# EAGLE design stepper-motor-driver (EAGLE 5.06)
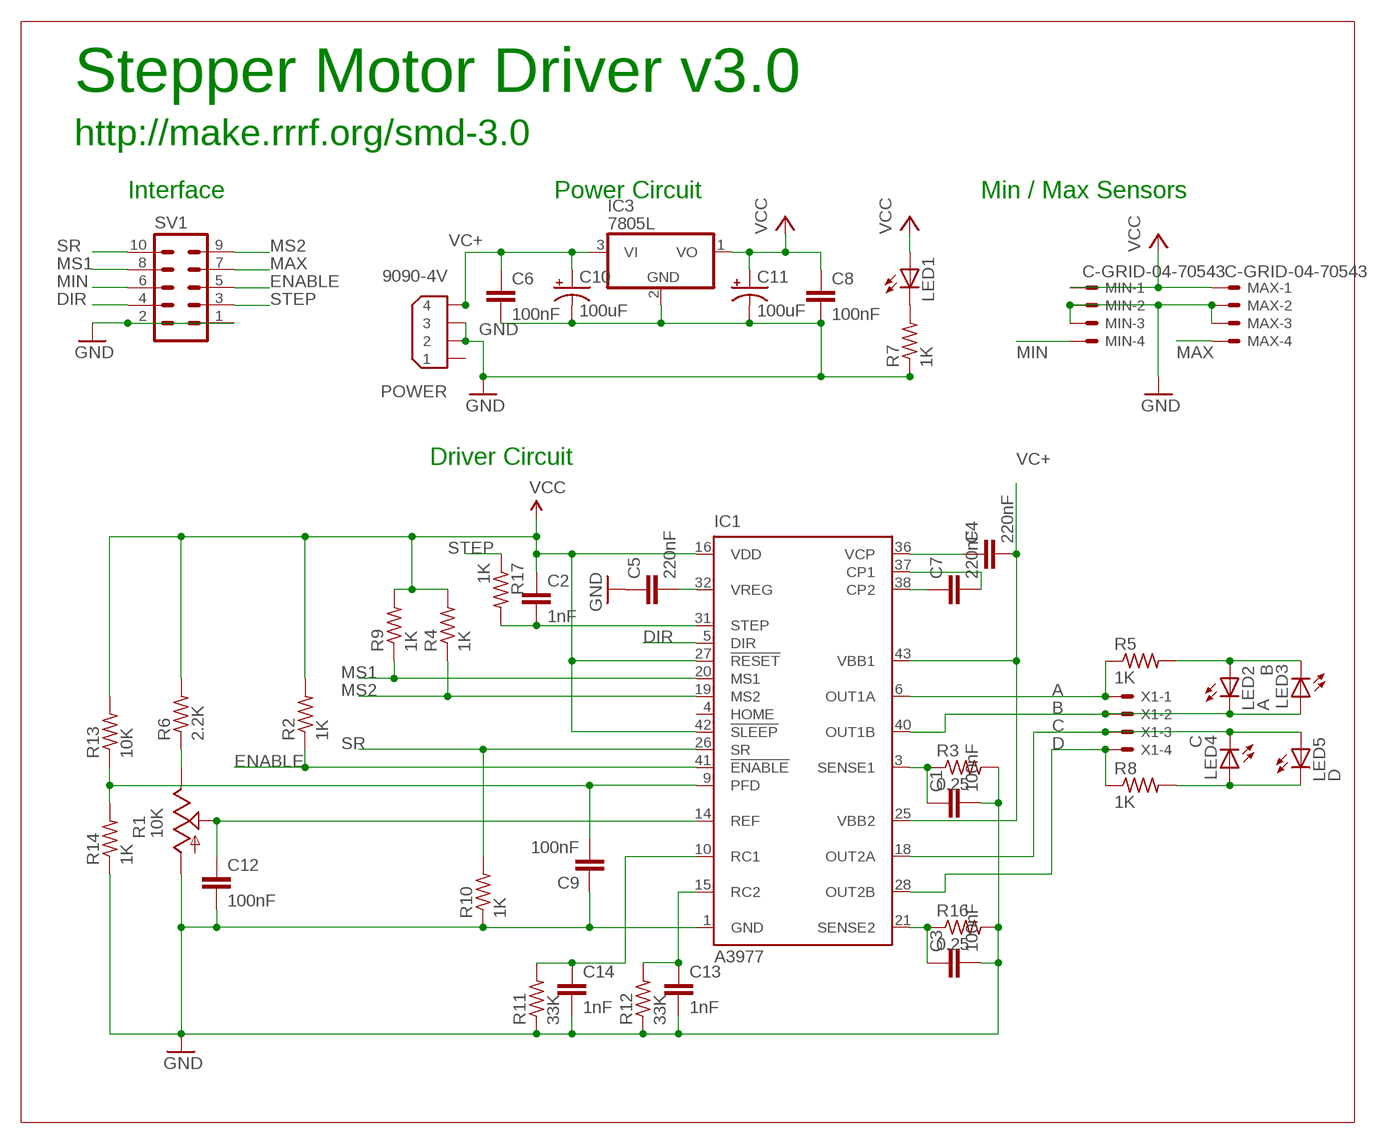
[diagram p0: schematic, sheet 1]

## Parts
C1  100nF  C-EUC1206  [C1206]
C2  1nF  C-EUC1206K  [C1206K]
C3  100nF  C-EUC1206  [C1206]
C4  220nF  C-EUC1206  [C1206]
C5  220nF  C-EUC1206  [C1206]
C6  100nF  C-EUC1206K  [C1206K]
C7  220nF  C-EUC1206  [C1206]
C8  100nF  C-EUC1206K  [C1206K]
C9  100nF  C-EUC1206  [C1206]
C10  100uF  CPOL-USE3.5-8  [E3,5-8]
C11  100uF  CPOL-USE3.5-8  [E3,5-8]
C12  100nF  C-EUC1206  [C1206]
C13  1nF  C-EUC1206  [C1206]
C14  1nF  C-EUC1206  [C1206]
IC1  A3977  [PLCC44]
IC3  7805L  [TO92]
LED1  LEDCHIPLED_1206  [CHIPLED_1206]
LED2  A  LEDCHIPLED_1206  [CHIPLED_1206]
LED3  B  LEDCHIPLED_1206  [CHIPLED_1206]
LED4  C  LEDCHIPLED_1206  [CHIPLED_1206]
LED5  D  LEDCHIPLED_1206  [CHIPLED_1206]
MAX  C-GRID-04-70543  [70543-04]
MIN  C-GRID-04-70543  [70543-04]
POWER  9090-4V  [9090-4V]
R1  10K  TRIM_US-B25P  [B25P]
R2  1K  R-US_R1206  [R1206]
R3  0.25  R-US_R2512  [R2512]
R4  1K  R-US_R1206  [R1206]
R5  1K  R-US_R1206  [R1206]
R6  2.2K  R-US_R1206  [R1206]
R7  1K  R-US_R1206  [R1206]
R8  1K  R-US_R1206  [R1206]
R9  1K  R-US_R1206  [R1206]
R10  1K  R-US_R1206  [R1206]
R11  33K  R-US_R1206  [R1206]
R12  33K  R-US_R1206  [R1206]
R13  10K  R-US_R1206  [R1206]
R14  1K  R-US_R1206  [R1206]
R16  0.25  R-US_R2512  [R2512]
R17  1K  R-US_R1206  [R1206]
SV1  ML10  [ML10]
X1  KK-156-4  [KK-156-4]

## Nets
A [Power]: IC1.6(OUT1A) R5.1 X1.1
B [Power]: IC1.40(OUT1B) LED2.C LED3.A X1.2
C [Power]: IC1.18(OUT2A) LED4.C LED5.A X1.3
D [Power]: IC1.28(OUT2B) R8.1 X1.4
DIR: IC1.5(DIR) SV1.4
ENABLE: IC1.41(!ENABLE) R2.1 SV1.5
GND [Power]: C1.2 C3.2 C5.1 C6.2 C8.2 C9.1 C10.- C11.- C12.2 C13.2 C14.2 IC1.1(GND) IC3.2(GND) MAX.2 MAX.3 MIN.2 MIN.3 POWER.2 POWER.3 R1.A R3.2 R7.1 R10.1 R11.1 R12.1 R14.1 R16.2 SV1.1 SV1.2
MAX: MAX.4 SV1.7
MIN: MIN.4 SV1.6
MS1: IC1.20(MS1) R9.1 SV1.8
MS2: IC1.19(MS2) R4.1 SV1.9
N$1: C1.1 IC1.3(SENSE1) R3.1
N$2: C3.1 IC1.21(SENSE2) R16.1
N$3: C9.2 IC1.9(PFD) R13.1 R14.2
N$4: C13.1 IC1.15(RC2) R12.2
N$5: C14.1 IC1.10(RC1) R11.2
N$6: R1.E R6.1
N$7: C5.2 IC1.32(VREG)
N$8: LED1.C R7.2
N$10 [Power]: LED2.A LED3.C R5.2
N$11: C7.1 IC1.38(CP2)
N$12 [Power]: LED4.A LED5.C R8.2
N$13: C12.1 IC1.14(REF) R1.S
N$14: C2.2 IC1.31(STEP) R17.2
N$15: C7.2 IC1.37(CP1)
N$16: C4.1 IC1.36(VCP)
SR: IC1.26(SR) R10.2 SV1.10
STEP: R17.1 SV1.3
VC+ [Power]: C4.2 C6.1 C10.+ IC1.25(VBB2) IC1.43(VBB1) IC3.3(VI) POWER.4
VCC: C2.1 C8.1 C11.+ IC1.16(VDD) IC1.27(!RESET) IC1.42(!SLEEP) IC3.1(VO) LED1.A MAX.1 MIN.1 R2.2 R4.2 R6.2 R9.2 R13.2
Unconnected: IC1.4(HOME) POWER.1

## Notes on the sheet
- Stepper Motor Driver v3.0
- http://make.rrrf.org/smd-3.0
- Interface | Power Circuit | Min / Max Sensors
- Driver Circuit

## Power pins joined to a net without a drawn wire
GND: IC1.2(GND) IC1.11(GND) IC1.12(GND) IC1.13(GND) IC1.22(GND) IC1.23(GND) IC1.24(GND) IC1.33(GND) IC1.34(GND) IC1.35(GND) IC1.44(GND)

## Library data of the parts
C1-C9 C13 C14 = rcl:C-EU: CAPACITOR, European symbol
C10 C11 = rcl:CPOL-US: POLARIZED CAPACITOR, American symbol
C12 = resistor:C-EU: CAPACITOR, European symbol
IC1 = linear:A3977: MICROSTEPPING DMOS DRIVER WITH TRANSLATOR Source: http://allegromicro.com/datafile/3977.pdf
IC3 = linear:78*: Positive VOLTAGE REGULATOR Source: http://cache.national.com/ds/LM/LM78L05.pdf http://www.fairchildsemi.com/ds/LM/LM7805.pdf
LED1-LED5 = led:LED: LED OSRAM: - CHIPLED LG R971, LG N971, LY N971, LG Q971, LY Q971, LO R971, LY R971 LH N974, LH R974 LS Q976, LO Q976, LY Q976 LO Q996 - Hyper CHIPLED LW Q18S LB Q993, LB Q99A, LB R99A - SideLED LS A670, LO A670, LY A670, LG A670, LP A670 LB A673, LV A673, LT A673, LW A673 LH A674 LY A675 LS A676, LA A676, LO A676, LY A676, LW A676 LS A679, LY A679, LG A679 - Hyper Micro SIDELED® LS Y876, LA Y876, LO Y876, LY Y876 LT Y87S - SmartLED LW L88C, LW L88S LB L89C, LB L89S, LG L890 LS L89K, LO L89K, LY L89K LS L896, LA L896, LO L896, LY L896 - TOPLED LS T670, LO T670, LY T670, LG T670, LP T670 LSG T670, LSP T670, LSY T670, LOP T670, LYG T670 LG T671, LOG T671, LSG T671 LB T673, LV T673, LT T673, LW T673 LH T674 LS T676, LA T676, LO T676, LY T676, LB T676, LH T676, LSB T676, LW T676 LB T67C, LV T67C, LT T67C, LS T67K, LO T67K, LY T67K, LW E67C LS E67B, LA E67B, LO E67B, LY E67B, LB E67C, LV E67C, LT E67C LW T67C LS T679, LY T679, LG T679 LS T770, LO T770, LY T770, LG T770, LP T770 LB T773, LV T773, LT T773, LW T773 LH T774 LS E675, LA E675, LY E675, LS T675 LS T776, LA T776, LO T776, LY T776, LB T776 LHGB T686 LT T68C, LB T68C - Hyper Mini TOPLED® LB M676 - Mini TOPLED Santana® LG M470 LS M47K, LO M47K, LY M47K Source: http://www.osram.convergy.de - LUMILED® LXK2-PW12-R00, LXK2-PW12-S00, LXK2-PW14-U00, LXK2-PW14-V00 LXK2-PM12-R00, LXK2-PM12-S00, LXK2-PM14-U00 LXK2-PE12-Q00, LXK2-PE12-R00, LXK2-PE12-S00, LXK2-PE14-T00, LXK2-PE14-U00 LXK2-PB12-K00, LXK2-PB12-L00, LXK2-PB12-M00, LXK2-PB14-N00, LXK2-PB14-P00, LXK2-PB14-Q00 LXK2-PR12-L00, LXK2-PR12-M00, LXK2-PR14-Q00, LXK2-PR14-R00 LXK2-PD12-Q00, LXK2-PD12-R00, LXK2-PD12-S00 LXK2-PH12-R00, LXK2-PH12-S00 LXK2-PL12-P00, LXK2-PL12-Q00, LXK2-PL12-R00 Source: www.luxeon.com
MAX MIN = reprap:C-GRID-04: CONNECTOR wire to board 2.54 mm (0.100") pitch header
POWER = con-thomas-betts:9090-4: Disk Drive Power four position Source: Thomas & Betts Electronic Interconnects Eiropean Edition 1998
R1 = reprap:TRIM_US-: POTENTIOMETER
R2 R4 R5 R9-R12 = resistor:R-US_: RESISTOR, American symbol
R3 R6-R8 R13 R14 R16 R17 = rcl:R-US_: RESISTOR, American symbol
SV1 = con-harting-ml:ML10: HARTING
X1 = con-molex:KK-156-4: KK 156 HEADER Source: http://www.molex.com/pdm_docs/sd/026604100_sd.pdf

## Net classes
0 default: width 0.381 mm
1 Power: width 0.635 mm, drill 0.381 mm, clearance 0.508 mm
2 Trunk: width 1.676 mm, clearance 0.508 mm

## Board
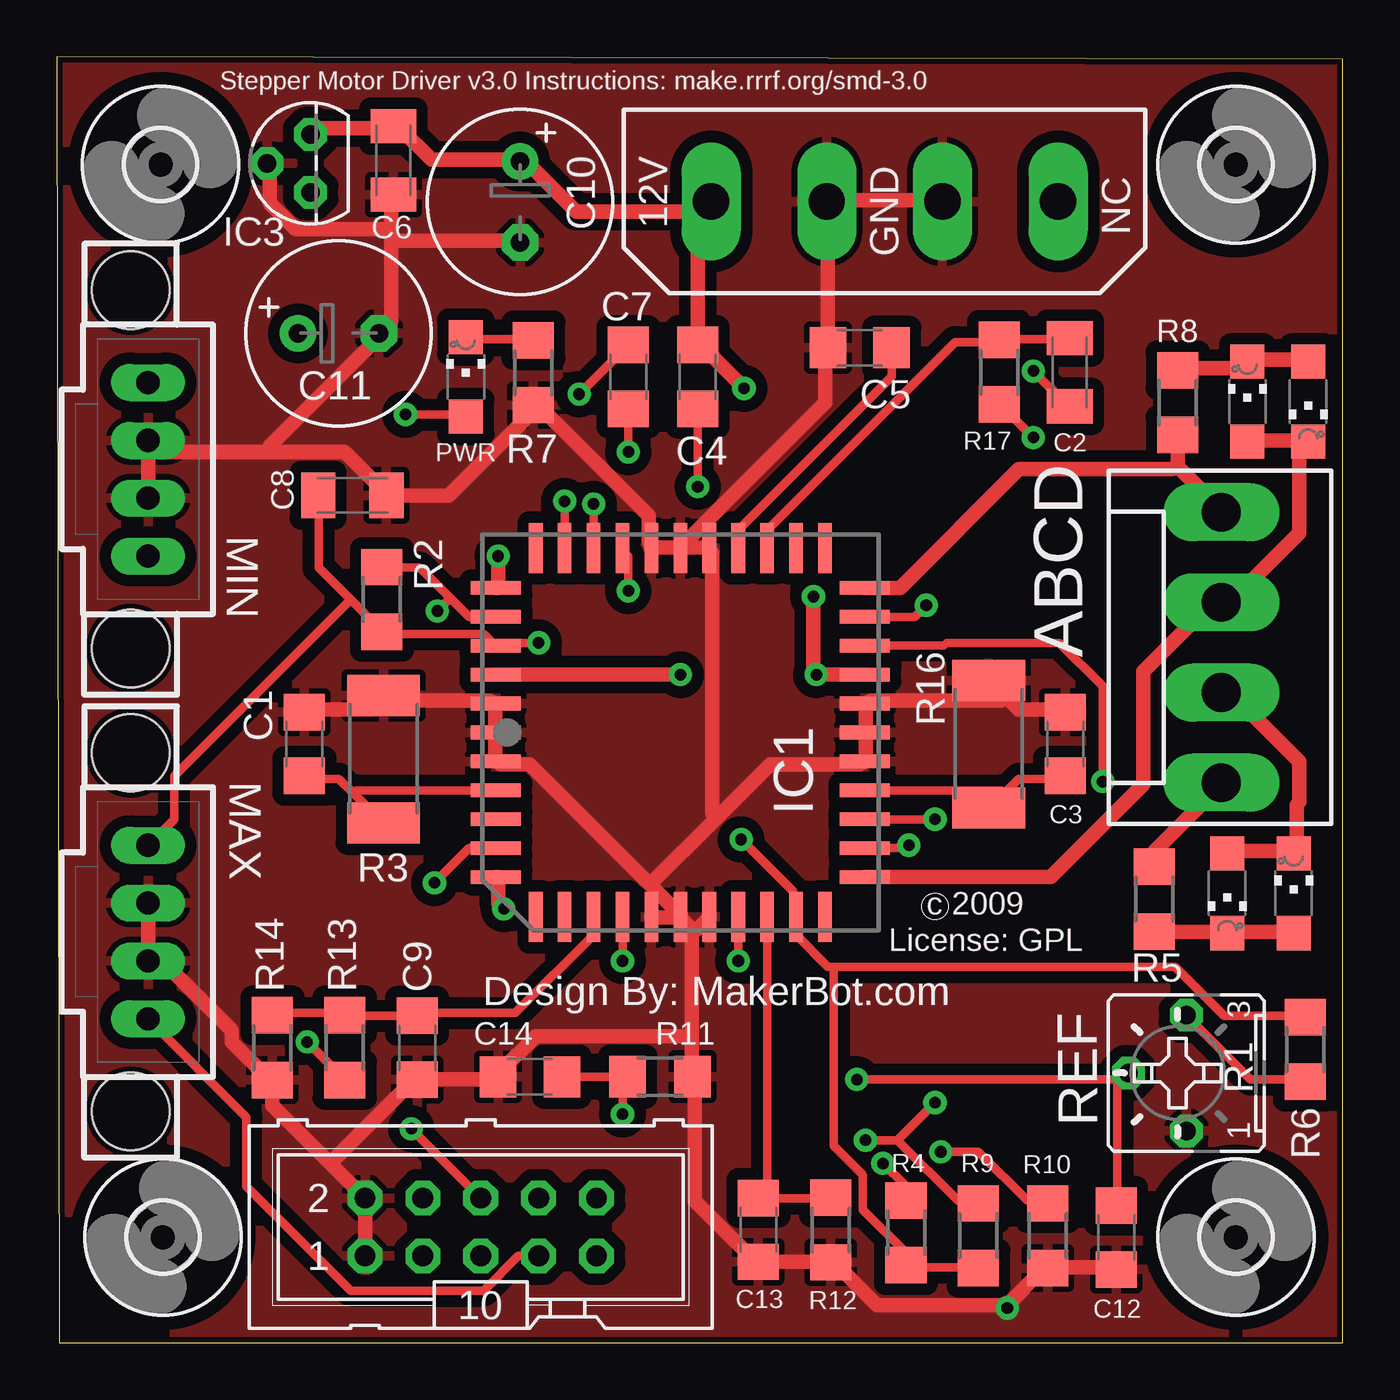
[diagram p1: board, top side]
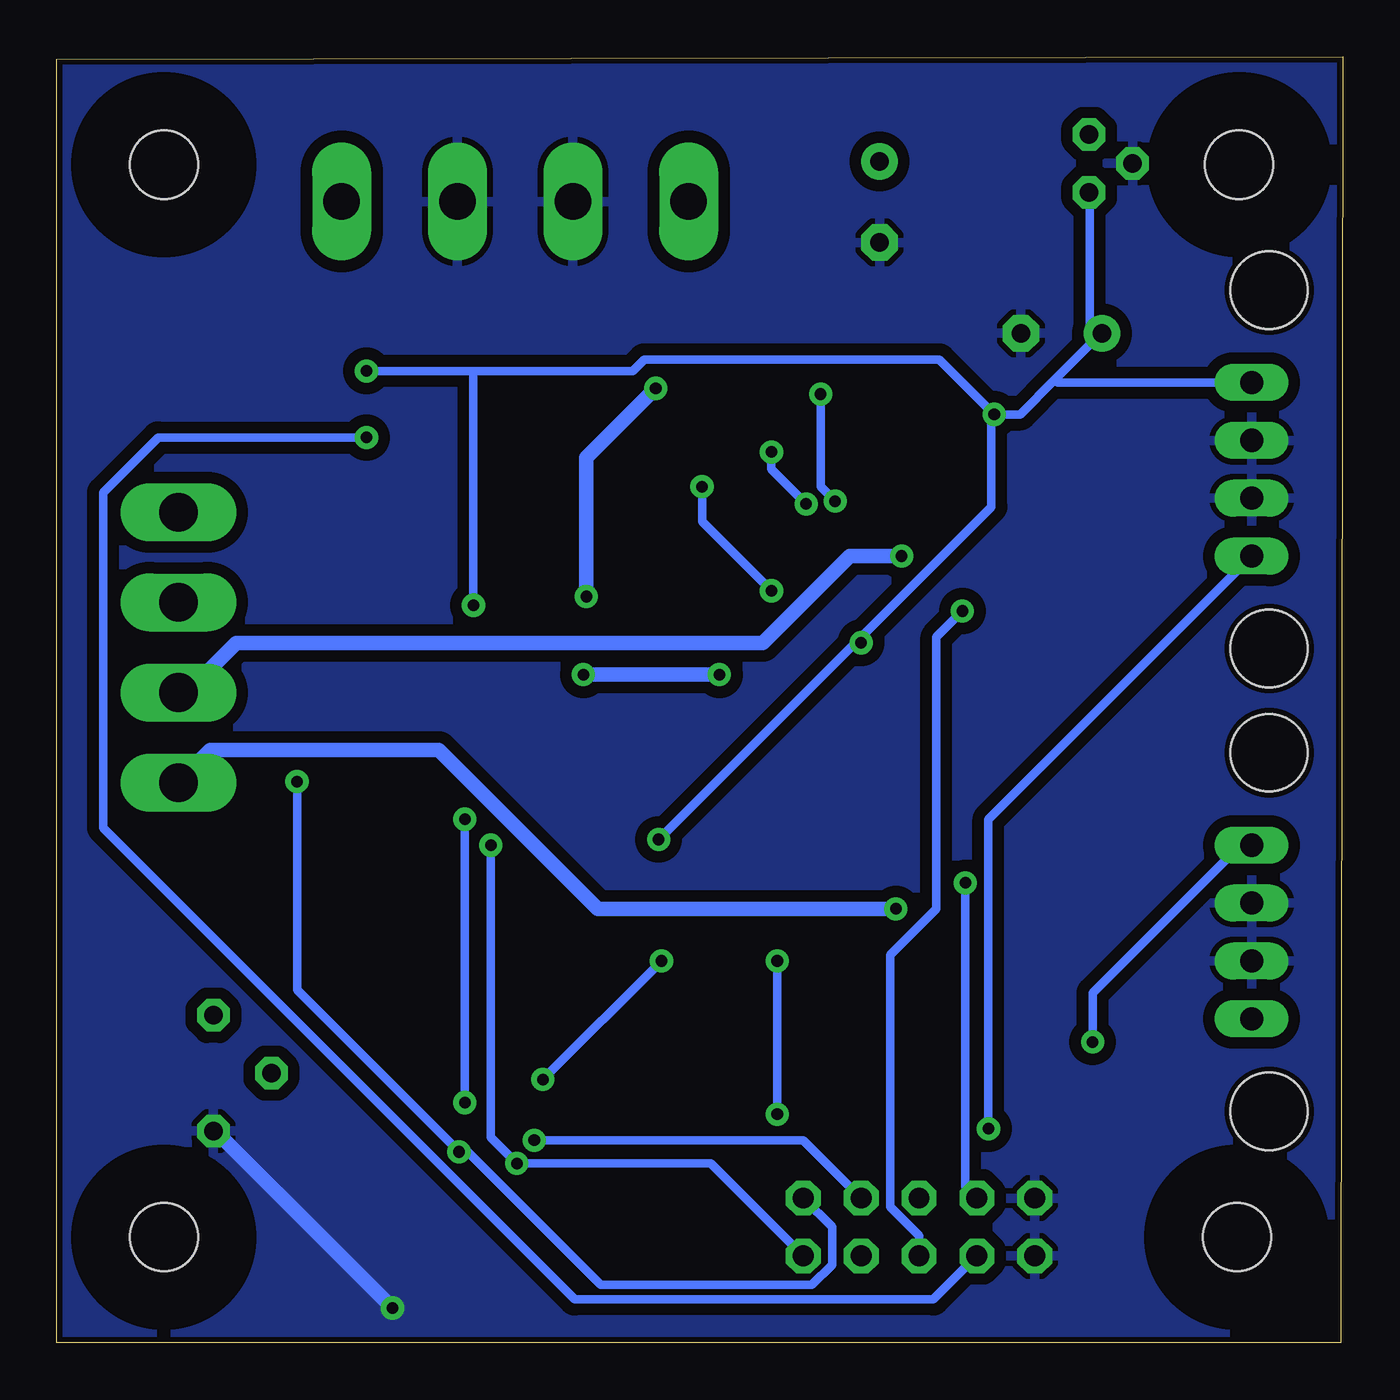
[diagram p2: board, bottom side, seen from below]

Size 56.45 x 56.46 mm. Coordinates in mm from the lower left corner, seen from the top.
Outline: 0.1,0 56.45,0 56.45,56.36 0,56.46 0.1,0
Copper layers (1*16): Top 0.035mm / dielectric 1.5mm / Bottom 0.035mm
Design rules "SparkFun": minimum track width 8mil, minimum drill 20mil, track to track 8mil, track to pad 8mil, pad to pad 8mil, via to via 8mil, smd to smd 8mil, copper to edge 10mil, drill to drill 8mil, minimum pad ring 12mil, minimum via ring 10mil, stop-mask expansion 4mil, vias tented up to drill 25mil, thermal gap 10mil

### Footprints (pad centres in the part's own frame; a part is rotated, then mirrored left to right if it is on the bottom)
C1206 = smd 1.6 x 1.8: 1 -1.4,0; 2 1.4,0
C1206K = smd 1.5 x 2: 1 -1.5,0; 2 1.5,0
E3,5-8 = drill 0.813 pad 1.6 round: + -1.778,0 | drill 0.813 pad 1.6 octagon: - 1.778,0
PLCC44 = smd 0.6 x 2.2: 1 0,8.1; 2 -1.27,8.1; 3 -2.54,8.1; 4 -3.81,8.1; 5 -5.08,8.1; 6 -6.35,8.1; 18 -6.35,-8.1; 19 -5.08,-8.1; 20 -3.81,-8.1; 21 -2.54,-8.1; 22 -1.27,-8.1; 23 0,-8.1; 24 1.27,-8.1; 25 2.54,-8.1; 26 3.81,-8.1; 27 5.08,-8.1; 28 6.35,-8.1; 40 6.35,8.1; 41 5.08,8.1; 42 3.81,8.1; 43 2.54,8.1; 44 1.27,8.1 | smd 2.2 x 0.6: 7 -8.1,6.35; 8 -8.1,5.08; 9 -8.1,3.81; 10 -8.1,2.54; 11 -8.1,1.27; 12 -8.1,0; 13 -8.1,-1.27; 14 -8.1,-2.54; 15 -8.1,-3.81; 16 -8.1,-5.08; 17 -8.1,-6.35; 29 8.1,-6.35; 30 8.1,-5.08; 31 8.1,-3.81; 32 8.1,-2.54; 33 8.1,-1.27; 34 8.1,0; 35 8.1,1.27; 36 8.1,2.54; 37 8.1,3.81; 38 8.1,5.08; 39 8.1,6.35
TO92 = drill 0.813 octagon: 1 -1.27,0; 2 0,1.905; 3 1.27,0
CHIPLED_1206 = smd 1.5 x 1.5: A 0,-1.75; C 0,1.75
70543-04 = drill 1.016 long: 1 -3.81,0; 2 -1.27,0; 3 1.27,0; 4 3.81,0 | hole 3.404: -7.874,-0.762; 7.874,-0.762
9090-4V = drill 1.6 pad 2.6 long: 1 -7.62,0; 2 -2.54,0; 3 2.54,0; 4 7.62,0
B25P = drill 0.813 octagon: A -2.54,0; E 2.54,0; S 0,2.54
R1206 = smd 1.6 x 1.803: 1 -1.422,0; 2 1.422,0
R2512 = smd 1.8 x 3.2: 1 -2.8,0; 2 2.8,0
ML10 = drill 0.914 octagon: 1 -5.08,-1.27; 2 -5.08,1.27; 3 -2.54,-1.27; 4 -2.54,1.27; 5 0,-1.27; 6 0,1.27; 7 2.54,-1.27; 8 2.54,1.27; 9 5.08,-1.27; 10 5.08,1.27
3,0 = hole 3: 0,0
KK-156-4 = drill 1.7 pad 2.184 long: 1 -5.94,0; 2 -1.98,0; 3 1.98,0; 4 5.94,0

### Placement (x,y rotation side)
C1  10.86,26.28 90 top
C2  44.46,42.62 90 top
C3  44.26,26.28 90 top
C4  28.13,42.41 90 top
C5  35.24,43.68 0 top
C6  14.77,51.91 270 top
C7  25.08,42.41 270 top
C8  12.97,37.21 0 top
C9  15.81,12.95 90 top
C10  20.33,50.08 270 top
C11  12.36,44.32 0 top
C12  46.5,4.61 270 top
C13  30.8,4.95 270 top
C14  20.76,11.68 180 top
IC1  27.37,26.79 90 top
IC3  11.14,51.79 90 top
LED1  17.95,42.41 0 top
LED2  54.29,19.73 0 top
LED3  51.37,19.73 180 top
LED4  54.93,41.32 180 top
LED5  52.26,41.32 0 top
MAX  4,18.03 270 top
MIN  4,38.35 270 top
POWER  36.33,50.11 180 top
R1  49.58,11.83 90 top
R2  14.26,32.63 270 top
R3  14.34,25.62 90 top
R4  37.27,4.82 270 top
R5  48.17,19.47 270 top
R6  54.8,12.87 90 top
R7  20.92,42.59 90 top
R8  49.2,41.28 90 top
R9  40.45,4.69 270 top
R10  43.5,4.69 90 top
R11  26.48,11.68 180 top
R12  33.97,4.95 90 top
R13  12.63,12.95 270 top
R14  9.46,12.95 90 top
R16  40.91,26.28 90 top
R17  41.36,42.62 90 top
SV1  18.6,5.07 0 top
U$1  [3,0]  4.55,51.73 0 top
U$2  [3,0]  51.75,51.73 0 top
U$3  [3,0]  4.65,4.63 0 top
U$4  [3,0]  51.75,4.63 0 top
X1  51.12,30.53 90 top

### Tracks (layer width: path | path; a pad name or v marks a point on that pad's centre or on a via)
A  (via drill 0.51)
  Top 0.635: R5.1 48.2,20.95 48.2,21.59 51.12,24.51 X1.1 | v19.62,19.05 19.37,19.3 19.37,20.44 IC1.6
  Bottom 0.635: v19.62,19.05 32.7,19.05 39.69,26.03 49.72,26.03 51.12,24.63 X1.1
B  (via drill 0.51)
  Top 0.635: LED3.A 51.37,21.59 54.29,21.59 LED2.C 54.42,21.84 54.42,23.62 54.55,23.74 54.55,25.52 51.62,28.44 51.12,28.44 X1.2 | v19.37,34.54 19.37,33.14 IC1.40
  Bottom 0.635: v19.37,34.54 21.65,34.54 25.46,30.73 48.58,30.73 50.73,28.57 51.12,28.57 X1.2
C
  Top 0.635: LED5.A 52.26,39.62 54.93,39.62 LED4.C 54.55,39.36 54.55,35.55 51.37,32.38 X1.3 51.12,32.38 50.61,32.38 47.69,29.46 47.69,24.51 43.62,20.44 IC1.18
D
  Top 0.635: 49.21,38.48 49.21,39.75 R8.1 | 49.21,38.48 51.12,36.57 X1.4 | IC1.28 37.02,33.14 42.23,38.35 48.96,38.35 49.21,38.48
DIR  (via drill 0.51)
  Top 0.381: v16.57,20.19 18.1,21.71 IC1.5
  Bottom 0.381: v16.57,20.19 16.57,6.85 SV1.4
ENABLE  (via drill 0.51)
  Top 0.381: 17.27,32.7 18.1,31.87 IC1.41 | 17.27,32.7 15.94,34.03 14.29,34.03 R2.1 | v16.7,32.13 17.27,32.7
  Bottom 0.381: SV1.5 18.6,4.69 19.87,5.96 19.87,17.01 17.84,19.05 17.84,30.98 v16.7,32.13
GND  (via drill 0.51)
  Top 0.635: 14.67,48.38 14.67,44.83 14.16,44.32 C11.- 14.03,44.06 9.33,39.36 9.33,39.11 | 14.67,48.38 14.67,48.89 | 14.67,48.89 14.67,50.29 C6.2 | IC3.2 9.33,51.68 9.33,50.03 10.48,48.89 14.67,48.89 | C10.- 20.26,48.38 14.67,48.38 | POWER.2 38.8,50.16 34.1,50.16 POWER.3 33.84,50.03 C5.1 33.72,43.43 33.72,41.27 27.62,35.17 IC1.34 | MIN.3 MIN.2 4.25,39.11 9.33,39.11 | IC1.34 27.37,34.92 26.1,34.92 IC1.35 25.97,35.17 25.97,36.32 21.14,41.14 R7.1 20.89,41.14 20.89,40.89 17.21,37.21 C8.2 14.29,37.46 12.63,39.11 9.33,39.11 | IC1.34 27.62,34.92 28.64,34.92 IC1.33 28.76,34.67 28.76,23.24 28.95,23.05 | C12.2 46.42,3.3 43.5,3.3 R10.1 43.24,3.17 41.72,1.65 | 41.72,1.65 36,1.65 34.22,3.42 R12.1 33.97,3.55 C13.2 30.54,3.68 28,6.22 28,11.42 R11.1 27.88,11.68 27.88,13.46 | 41.72,1.65 v41.72,1.52 | C3.2 44.26,27.81 42.23,27.81 40.96,29.08 R16.2 41.46,28.19 35.75,28.19 IC1.24 35.5,28.06 35.5,27.05 IC1.23 35.5,26.79 35.5,25.52 IC1.22 35.24,25.39 31.3,25.39 28.95,23.05 | C1.2 10.86,27.81 13.78,27.81 14.29,28.32 R3.2 14.54,28.19 18.98,28.19 IC1.44 19.24,28.06 19.24,27.05 IC1.1 19.24,26.79 19.24,25.52 IC1.2 19.49,25.39 20.76,25.39 26.03,20.12 | 27.88,13.46 27.88,18.16 | 27.88,18.16 27.37,18.66 IC1.12 | IC1.11 26.1,18.66 27.11,18.66 IC1.12 | IC1.13 28.64,18.66 28.13,18.16 27.88,18.16 | MAX.2 MAX.3 4.25,16.63 4.76,16.63 7.68,13.71 7.68,13.2 9.21,11.68 R14.1 9.46,10.41 12,7.87 | 12,7.87 SV1.2 SV1.1 | 12,7.87 15.56,11.42 C9.1 19.11,11.55 19.24,11.68 C14.2 19.49,11.93 21.02,13.46 27.88,13.46 | 26.03,20.12 27.24,18.92 IC1.12 | 26.03,20.12 28.95,23.05
  Bottom 0.635: v41.72,1.52 49.47,9.27 R1.A
  pour Top: -1.21,57.91 57.21,57.91 57.21,-0.51 -1.21,-0.51
  pour Bottom: -1.21,57.91 57.21,57.91 57.21,-0.51 -1.21,-0.51
MAX
  Top 0.381: SV1.7 20.26,3.8 18.73,2.28 12.89,2.28 8.32,6.85 8.32,9.9 MAX.4
MIN  (via drill 0.51)
  Top 0.381: SV1.6 v15.56,9.39
  Bottom 0.381: v15.56,9.39 15.56,22.98 MIN.4
MS1  (via drill 0.51)
  Top 0.381: 36.89,8.88 39.56,6.22 40.45,6.22 R9.1 | v35.5,8.88 36.89,8.88 | v38.54,22.98 IC1.20 | 36.89,8.88 v38.54,10.54
  Bottom 0.381: v35.5,8.88 23.68,8.88 SV1.8 | v38.54,10.54 v38.54,22.98
MS2  (via drill 0.51)
  Top 0.381: v36.26,7.87 37.27,6.85 R4.1 | v37.4,21.84 37.27,21.71 IC1.19
  Bottom 0.381: SV1.9 27.75,7.87 v36.26,7.87 37.4,9.01 v37.4,21.84
N$1
  Top 0.381: 13.02,24.12 14.29,22.85 R3.1 | 13.02,24.12 12.38,24.76 10.86,24.76 C1.1 | IC1.3 13.14,24.25 13.02,24.12
N$2
  Top 0.381: C3.1 44.26,24.76 42.23,24.76 40.96,23.49 R16.1 41.46,24.25 IC1.21
N$3
  Top 0.381: R14.2 9.46,14.47 12.51,14.47 R13.1 12.63,14.35 C9.2 15.94,14.47 20.13,14.47 23.56,17.9 IC1.9
N$4
  Top 0.381: R12.2 33.97,6.35 C13.1 31.18,6.47 IC1.15
N$5  (via drill 0.51)
  Top 0.381: C14.1 R11.2 24.83,11.55 v24.83,10.03 | v24.83,16.76 IC1.10
  Bottom 0.381: v24.83,10.03 v24.83,16.76
N$6
  Top 0.381: R6.1 54.8,11.55 52.39,11.55 49.59,14.35 R1.E
N$7
  Top 0.381: C5.2 36.64,42.41 29.91,35.68 IC1.32
N$8
  Top 0.381: LED1.C 17.97,44.06 20.89,44.06 R7.2
N$10
  Top 0.635: LED2.A 54.29,18.03 51.37,18.03 LED3.C 51.12,18.03 48.2,18.03 R5.2
N$11  (via drill 0.51)
  Top 0.381: v22.92,41.65 C7.1 | IC1.38 v22.29,36.95
  Bottom 0.381: v22.92,41.65 22.92,37.59 v22.29,36.95
N$12
  Top 0.635: LED4.A 54.93,43.17 52.26,43.17 LED5.C 52.13,42.79 49.21,42.79 R8.2
N$13  (via drill 0.51)
  Top 0.381: C12.1 46.54,6.09 46.54,11.42 46.92,11.81 R1.S 46.42,11.55 v35.11,11.55 | v29.91,16.76 IC1.14
  Bottom 0.381: v35.11,11.55 v29.91,16.76
N$14
  Top 0.381: C2.2 44.39,44.06 41.46,44.06 R17.2 41.21,43.94 39.43,43.94 31.18,35.68 IC1.31
N$15  (via drill 0.51)
  Top 0.381: v25.08,39.11 C7.2 | IC1.37 v23.56,36.82
  Bottom 0.381: v25.08,39.11 25.08,38.35 v23.56,36.82
N$16  (via drill 0.51)
  Top 0.381: v25.08,33.02 25.08,34.54 24.83,34.79 IC1.36 | v28.13,37.59 C4.1
  Bottom 0.381: v28.13,37.59 28.13,36.06 v25.08,33.02
SR  (via drill 0.51)
  Top 0.381: v38.8,8.38 40.45,8.38 42.61,6.22 43.5,6.22 R10.2 | v45.91,24.63 45.91,28.82 44,30.73 39.05,30.73 38.92,30.6 IC1.26
  Bottom 0.381: SV1.10 22.41,5.07 22.41,3.42 23.3,2.54 32.57,2.54 38.42,8.38 v38.8,8.38 45.91,15.49 v45.91,24.63
STEP  (via drill 0.51)
  Top 0.381: v42.86,39.75 41.46,41.14 R17.1
  Bottom 0.381: v42.86,39.75 52,39.75 54.42,37.33 54.42,22.6 33.72,1.9 17.97,1.9 SV1.3
VC+  (via drill 0.51)
  Top 0.635: IC1.43 v27.37,29.33 | IC1.25 v33.34,29.33 33.21,29.59 v33.21,32.76 | IC3.3 11.24,53.08 11.49,53.33 14.67,53.33 C6.1 15.05,53.33 16.45,51.94 20.26,51.94 C10.+ 20.64,51.81 22.8,49.65 27.88,49.65 POWER.4 28.13,49.52 C4.2 28.38,43.68 v30.16,41.91
  Bottom 0.635: v27.37,29.33 v33.34,29.33 | v33.21,32.76 33.21,38.86 v30.16,41.91
VCC  (via drill 0.51)
  Top 0.381: 12.89,32.63 14.16,31.36 R2.2 14.29,31.11 18.73,31.11 19.24,30.6 IC1.42 19.37,30.73 v21.14,30.73 | 12.89,32.63 11.49,34.03 11.49,37.21 C8.1 | v10.98,13.2 12.63,11.55 R13.2 | MAX.1 5.14,22.98 5.14,24.89 12.89,32.63 | R9.2 40.45,3.3 37.27,3.3 R4.2 37.27,3.93 35.37,5.84 35.37,7.36 34.1,8.63 34.1,16.51 | 34.1,16.51 33.84,16.51 32.45,17.9 IC1.16 32.32,18.79 32.32,19.81 v30.03,22.09 | 34.1,16.51 49.08,16.51 51.24,14.35 54.8,14.35 R6.2 | v15.3,40.76 17.84,40.76 LED1.A | v42.86,42.67 44.39,41.14 C2.1 | v38.16,32.38 37.65,31.87 IC1.27
  Bottom 0.381: v10.98,13.2 10.98,15.36 4.51,21.84 MAX.1 | v15.3,40.76 14.16,40.76 12.63,42.29 | 12.63,42.29 10.6,44.32 C11.+ 11.11,44.06 11.11,50.41 IC3.1 | 38.16,42.67 31.18,42.67 30.67,43.17 17.72,43.17 v15.3,40.76 | 38.16,42.67 v42.86,42.67 | 38.16,42.67 v38.16,32.38 | MIN.1 12.51,42.16 12.63,42.29 | 21.27,30.86 15.43,36.7 15.43,40.63 v15.3,40.76 | 21.27,30.86 v30.03,22.09 | v21.14,30.73 21.27,30.86

### Text on the board
tPlace: Stepper Motor Driver v3.0 Instructions: make.rrrf.org/smd-3.0 | 12V | GND | NC | PWR | ABCD | c 2009 | License: GPL | Design By: MakerBot.com | REF